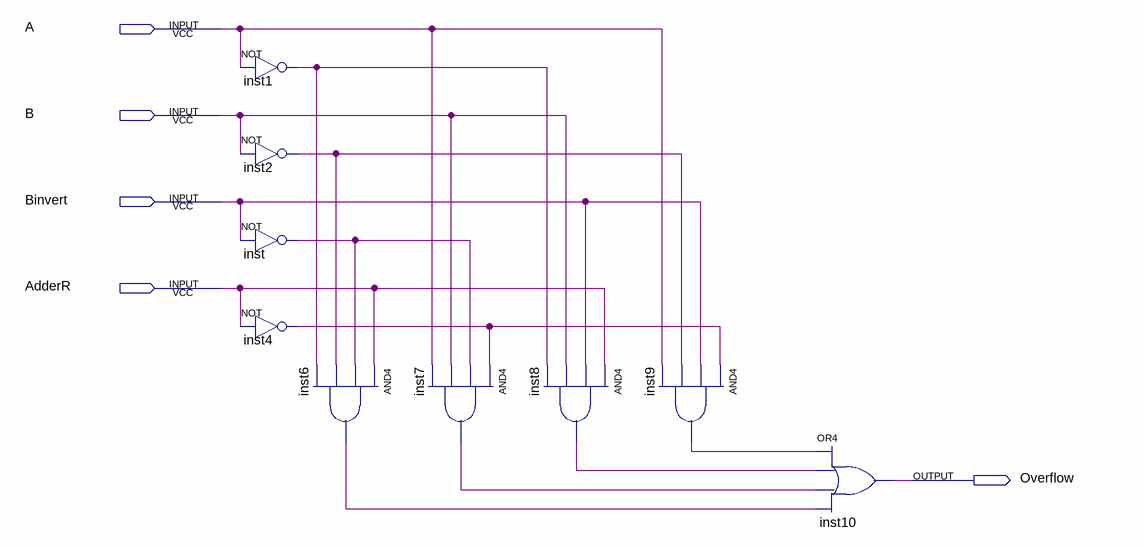
[diagram p0: schematic sheet]
// Quartus schematic Overflow.bdf as structural Verilog: 9 symbols, 5 pins
module Overflow (
  input  A,
  input  B,
  input  Binvert,
  input  AdderR,
  output Overflow
);

  wire inst1_out, inst2_out, inst4_out, inst6_out, inst7_out, inst8_out, inst9_out, inst_out;

  not inst1 (inst1_out, A);
  not inst2 (inst2_out, B);
  not inst (inst_out, Binvert);
  not inst4 (inst4_out, AdderR);
  and inst6 (inst6_out, AdderR, inst_out, inst2_out, inst1_out);
  and inst7 (inst7_out, inst4_out, inst_out, B, A);
  and inst8 (inst8_out, AdderR, Binvert, B, inst1_out);
  and inst9 (inst9_out, inst4_out, Binvert, inst2_out, A);
  or inst10 (Overflow, inst9_out, inst8_out, inst7_out, inst6_out);
endmodule
